# Altium schematic sheet button_mcu.SchDoc
size A4
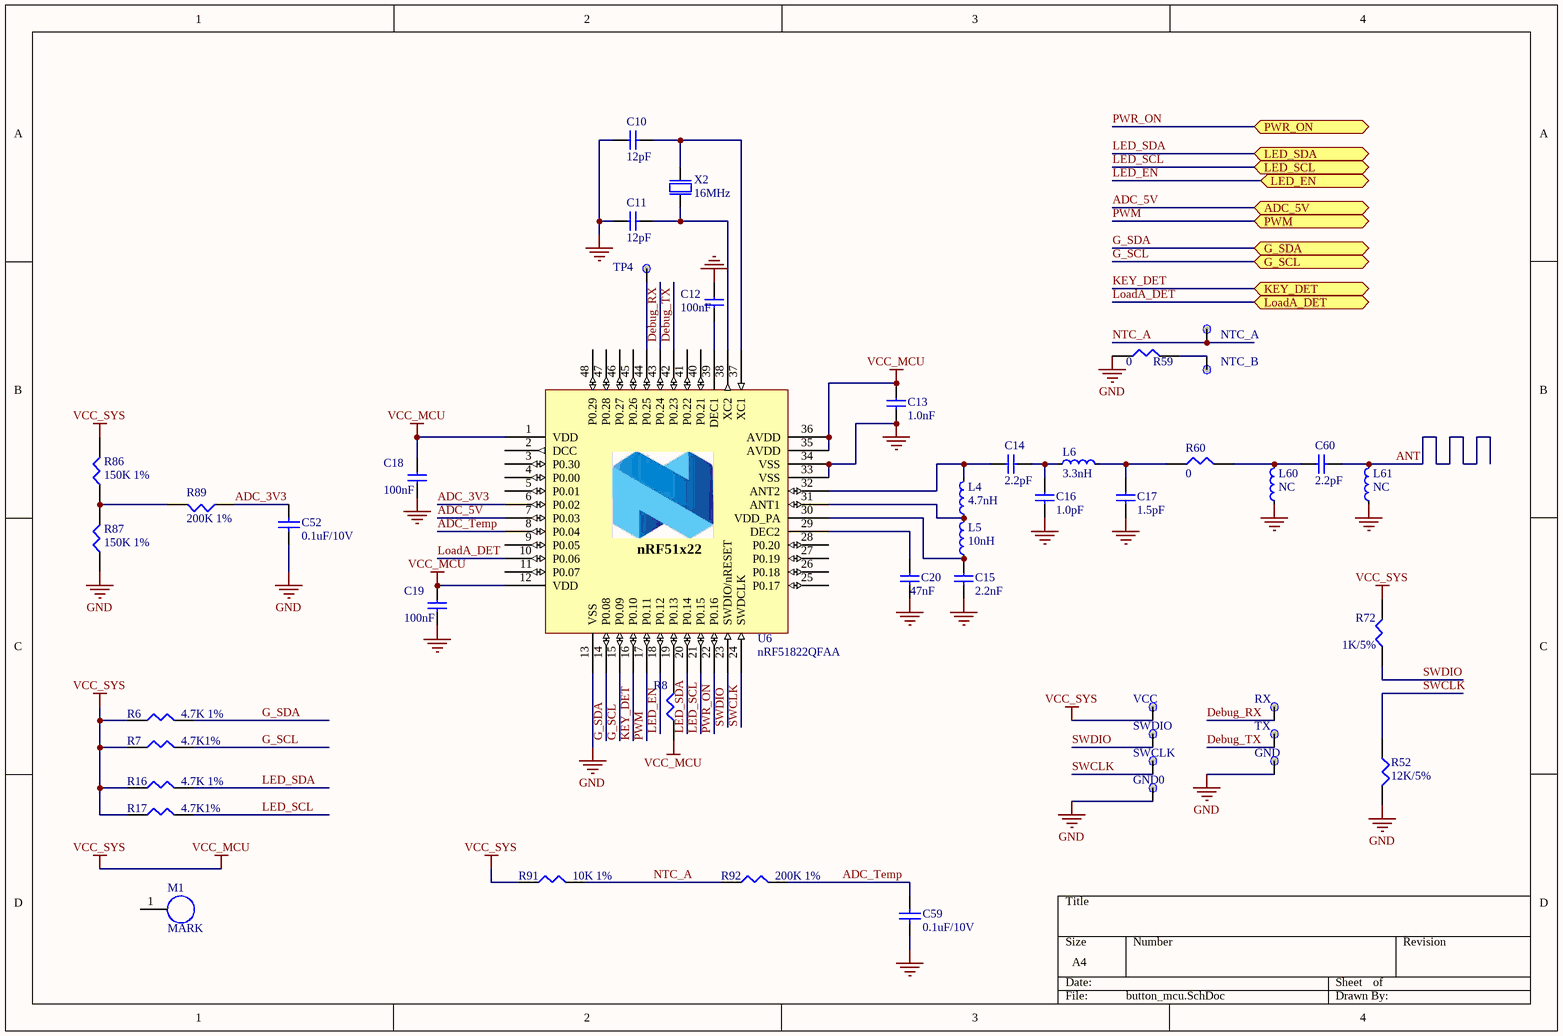
[diagram p0: button_mcu.SchDoc]

## Parts
C10  12pF  [CAPC1005X04L]
C11  12pF  [CAPC1005X04L]
C12  100nF  [CAPC1005X04L]
C13  1.0nF  [CAPC1005X04L]
C14  2.2pF  [CAPC1005X04L]
C15  2.2nF  [CAPC1005X04L]
C16  1.0pF  [CAPC1005X04L]
C17  1.5pF  [CAPC1005X04L]
C18  100nF  [CAPC1005X04L]
C19  100nF  [CAPC1005X04L]
C20  47nF  [CAPC1005X04L]
C52  0.1uF/10V  [0402C]
C59  0.1uF/10V  [0402C]
C60  2.2pF  [0402C]
GND  TP  [TESTPOINT2]  (value not drawn)
GND0  TP  [TESTPOINT2]  (value not drawn)
L4  4.7nH  [INDC1005X04L]
L5  10nH  [INDC1005X04L]
L6  3.3nH  [INDC1005X04L]
L60  NC  [0402R]
L61  NC  [0402R]
M1  MARK  [Mark Point]
NTC_A  TP  [TESTPOINT_PAD]  (value not drawn)
NTC_B  TP  [TESTPOINT_PAD]  (value not drawn)
R6  4.7K 1%  [0402R]
R7  4.7K1%  [0402R]
R8  1K 5%  [0402R]  (value not drawn)
R16  4.7K 1%  [0402R]
R17  4.7K1%  [0402R]
R52  12K/5%  [0402R]
R59  0  [0402R]
R60  0  [0402R]
R72  1K/5%  [0402R]
R86  150K 1%  [0402R]
R87  150K 1%  [0402R]
R89  200K 1%  [0402R]
R91  10K 1%  [0402R]
R92  200K 1%  [0402R]
RX  TP  [TESTPOINT2]  (value not drawn)
SWCLK  TP  [TESTPOINT2]  (value not drawn)
SWDIO  TP  [TESTPOINT2]  (value not drawn)
TP4  TP  [TESTPOINT2]  (value not drawn)
TX  TP  [TESTPOINT2]  (value not drawn)
U6  nRF51822QFAA  [QFN40P600X600X90-48N]
VCC  TP  [TESTPOINT2]  (value not drawn)
X2  16MHz  [XTAL/3225]

## Ports
ADC_5V, G_SCL, G_SDA, KEY_DET, LED_EN, LED_SCL, LED_SDA, LoadA_DET, PWM, PWR_ON

## Nets
GND: C10.2 C11.2 C12.1 C13.2 C15.2 C16.2 C17.2 C18.2 C19.2 C20.2 C52.1 C59.1 GND.1 GND0.1 L60.1 L61.1 R52.2 R59.1 R87.1 U6.13(VSS) U6.33(VSS) U6.34(VSS) U6.49 X2.2(GND) X2.4(GND)
VCC_MCU: C13.1 C18.1 C19.1 R6.1 R7.1 R8.1 R16.1 R17.1 R72.2 R86.2 R91.1 U6.1(VDD) U6.12(VDD) U6.35(AVDD) U6.36(AVDD) VCC.1  [also labelled VCC_SYS]
ADC_3V3: C52.2 R89.1 U6.6(P0.02)
ADC_5V: U6.7(P0.03) ; port ADC_5V
ADC_Temp: C59.2 R92.2 U6.8(P0.04)
ANT: C60.2 L61.2
Debug_RX: RX.1 U6.43(P0.24)
Debug_TX: TX.1 U6.42(P0.23)
G_SCL: R7.2 U6.15(P0.09) ; port G_SCL
G_SDA: R6.2 U6.14(P0.08) ; port G_SDA
KEY_DET: U6.16(P0.10) ; port KEY_DET
LED_EN: U6.18(P0.12) ; port LED_EN
LED_SCL: R17.2 U6.21(P0.15) ; port LED_SCL
LED_SDA: R16.2 U6.20(P0.14) ; port LED_SDA
LoadA_DET: U6.10(P0.06) ; port LoadA_DET
NTC_A: NTC_A.1 R91.2 R92.1
PWM: U6.17(P0.11) ; port PWM
PWR_ON: U6.22(P0.16) ; port PWR_ON
SWCLK: R52.1 SWCLK.1 U6.24(SWDCLK)
SWDIO: R72.1 SWDIO.1 U6.23(SWDIO/nRESET)
NetC10_1: C10.1 U6.37(XC1) X2.1(inp)
NetC11_1: C11.1 U6.38(XC2) X2.3(out)
NetC12_2: C12.2 U6.39(DEC1)
NetC14_1: C14.1 L4.2 U6.32(ANT2)
NetC14_2: C14.2 C16.1 L6.1
NetC15_1: C15.1 L5.1 U6.30(VDD_PA)
NetC17_1: C17.1 L6.2 R60.1
NetC20_1: C20.1 U6.29(DEC2)
NetC60_1: C60.1 L60.2 R60.2
NetL4_1: L4.1 L5.2 U6.31(ANT1)
NetNTC_B_1: NTC_B.1 R59.2
NetR8_2: R8.2 U6.19(P0.13)
NetR86_1: R86.1 R87.2 R89.2
NetTP4_1: TP4.1 U6.44(P0.25)

Not connected (* = marked no-connect by the designer): M1 1; U6 2(DCC) 3(P0.30) 4(P0.00) 5(P0.01) 9(P0.05) 11(P0.07) 25(P0.17) 26(P0.18) 27(P0.19) 28(P0.20) 40(P0.21) 41(P0.22) 45(P0.26) 46(P0.27) 47(P0.28) 48(P0.29)

## Notes on the sheet
- (in symbol nRF51x22-QFAC) nRF51x22

## Library data of the parts
C10 C11 = C0402-12p: Capacitor, NP0, ±2%; Note: 50V; Artikkelnr Noca: 20029159; Artikkelnr Simpro: N.A.; Part Number: C0402-12p; Manufacturer: *; Manufacturer Part Number: *; Datasheet: *; LatestRevisionDate: 2011-05-11; Pin Count: 2; Publisher: Nordic Semiconductor; Published: 2009-05-08; Value: 12pF; Supplier: *; Supplier part number: *; 2nd source Supplier: *; 2nd source part number: *; Footprint Doc: 0402
C12 C18 C19 = C0402-100n: Capacitor, X7R, ±10%; Note: 16V; Artikkelnr Noca: 20039200; Artikkelnr Simpro: N.A.; Part Number: C0402-100n; Manufacturer: *; Manufacturer Part Number: *; Datasheet: *; LatestRevisionDate: 2009-11-23; Pin Count: 2; Publisher: Nordic Semiconductor; Published: 2009-05-08; Value: 100nF; Supplier: *; Supplier part number: *; 2nd source Supplier: *; 2nd source part number: *; Footprint Doc: 0402
C13 = C0402-1n0: Capacitor, X7R, ±10%; Note: 50V; Artikkelnr Noca: 20039223; Artikkelnr Simpro: N.A.; Part Number: C0402-1n0; Manufacturer: *; Manufacturer Part Number: *; Datasheet: *; LatestRevisionDate: 2009-11-23; Pin Count: 2; Publisher: Nordic Semiconductor; Published: 2009-05-08; Value: 1.0nF; Supplier: *; Supplier part number: *; 2nd source Supplier: *; 2nd source part number: *; Footprint Doc: 0402
C14 C60 = C0402-3.9p: Capacitor, NP0, ±0.1pF; Value: 3.9pF; Note: 50V; Artikkelnr Noca: N.A.; Part Number: C0402-3.9p; Manufacturer: *; Manufacturer Part Number: *; Datasheet: *; LatestRevisionDate: 2014-09-17; Pin Count: 2; Publisher: Nordic Semiconductor; Published: 2009-05-08; Supplier: *; Supplier part number: *; 2nd source Supplier: *; 2nd source part number: *; Footprint Doc: 0402; Artikkelnr Simpro: N.A.
C15 = C0402-2n2: Capacitor, X7R, ±10%; Note: 50V; Artikkelnr Noca: 20039221; Artikkelnr Simpro: N.A.; Part Number: C0402-2n2; Manufacturer: *; Manufacturer Part Number: *; Datasheet: *; LatestRevisionDate: 2009-11-23; Pin Count: 2; Publisher: Nordic Semiconductor; Published: 2009-05-08; Value: 2.2nF; Supplier: *; Supplier part number: *; 2nd source Supplier: *; 2nd source part number: *; Footprint Doc: 0402
C16 = C0402-1.0p: Capacitor, NP0, ±0.1pF; Note: 50V; Artikkelnr Noca: 20029140; Artikkelnr Simpro: N.A.; Part Number: C0402-1.0p; Manufacturer: *; Manufacturer Part Number: *; Datasheet: *; LatestRevisionDate: 2009-11-23; Pin Count: 2; Publisher: Nordic Semiconductor; Published: 2009-05-08; Value: 1.0pF; Supplier: *; Supplier part number: *; 2nd source Supplier: *; 2nd source part number: *; Footprint Doc: 0402
C17 = C0402-1.5p: Capacitor, NP0, ±0.1pF; Note: 50V; Artikkelnr Noca: 20029139; Artikkelnr Simpro: N.A.; Part Number: C0402-1.5p; Manufacturer: *; Manufacturer Part Number: *; Datasheet: *; LatestRevisionDate: 2009-11-23; Pin Count: 2; Publisher: Nordic Semiconductor; Published: 2009-05-08; Value: 1.5pF; Supplier: *; Supplier part number: *; 2nd source Supplier: *; 2nd source part number: *; Footprint Doc: 0402
C20 = C0402-47n: Capacitor, X7R, ±10%; Note: Chip Cap 10%; Artikkelnr Noca: 20039389; Artikkelnr Simpro: N.A.; Part Number: C0402-47n; Manufacturer: *; Manufacturer Part Number: *; Datasheet: *; LatestRevisionDate: 2009-05-08; Pin Count: 2; Publisher: Nordic Semiconductor; Published: 2009-05-08; Value: 47nF; Supplier: *; Supplier part number: *; 2nd source Supplier: *; 2nd source part number: *; Footprint Doc: 0402
C52 C59 = CAP: Capacitor; Value: 100pF; Ordered by: Subcon; Published: 8-Jun-2000; Revision: July-2002: Re-released for DXP Platform.; Publisher: Altium Limited
GND GND0 NTC_A NTC_B RX SWCLK SWDIO TP4 TX VCC = TP: Ordered by: Subcon
L4 = L0402-4n7: High frequency chip inductor ±5%; Manufacturer: Murata; Manufacturer Part Number: LQP15MN4N7B02D; Artikkelnr Noca: 33029164; Artikkelnr Simpro: N.A.; Part Number: L0402-4n7; Datasheet: http://search.murata.co.jp/Ceramy/image/img/PDF/ENG/L0075S0084LQP15M.pdf; LatestRevisionDate: 2012-09-19; Pin Count: 2; Publisher: Nordic Semiconductor; Published: 2009-05-08; Value: 4.7nH; Note: High frequency chip inductor ±5%; Supplier: Digi-Key; Supplier part number: 490-1132-1-ND; 2nd source Supplier: *; 2nd source part number: *; Footprint Doc: 0402
L5 = L0402-27n: High frequency chip inductor ±5%; Manufacturer: Murata; Manufacturer Part Number: LQP15MN27NG02D; Value: 27nH; Note: High frequency chip inductor ±2%; Artikkelnr Noca: N.A.; Part Number: L0402-27n; Datasheet: http://search.murata.co.jp/Ceramy/image/img/PDF/ENG/L0075S0084LQP15M.pdf; LatestRevisionDate: 2014-09-17; Pin Count: 2; Publisher: Nordic Semiconductor; Published: 2014-06-12; Supplier: Digi-Key; Supplier part number: 490-6751-1-ND; 2nd source Supplier: *; 2nd source part number: *; Footprint Doc: 0402; Artikkelnr Simpro: N.A.
L6 = L0402-3n3: High frequency chip inductor ±5%; Manufacturer: Murata; Manufacturer Part Number: LQP15MN3N3B02D; Artikkelnr Noca: 33029369; Artikkelnr Simpro: N.A.; Part Number: L0402-3n3; Datasheet: http://search.murata.co.jp/Ceramy/image/img/PDF/ENG/L0075S0084LQP15M.pdf; LatestRevisionDate: 2012-09-19; Pin Count: 2; Publisher: Nordic Semiconductor; Published: 2009-05-08; Value: 3.3nH; Note: High frequency chip inductor ±5%; Supplier: Digi-Key; Supplier part number: 490-1130-1-ND; 2nd source Supplier: *; 2nd source part number: *; Footprint Doc: 0402
L60 L61 = L0402-4n7: High frequency chip inductor ±5%; Manufacturer: Murata; Manufacturer Part Number: LQP15MN4N7B02D; Value: 4.7nH; Artikkelnr Noca: 33029164; Artikkelnr Simpro: N.A.; Part Number: L0402-4n7; Datasheet: http://search.murata.co.jp/Ceramy/image/img/PDF/ENG/L0075S0084LQP15M.pdf; LatestRevisionDate: 2012-09-19; Pin Count: 2; Publisher: Nordic Semiconductor; Published: 2009-05-08; Note: High frequency chip inductor ±5%; Supplier: Digi-Key; Supplier part number: 490-1132-1-ND; 2nd source Supplier: *; 2nd source part number: *; Footprint Doc: 0402
M1 = PAD1: None
R6-R8 R16 R17 R52 R59 R60 R72 R86 R87 R89 R91 R92 = RES1: 厂家：Yageo，型号：RC0402FR-0720RL
U6 = nRF51x22-QFAC: Multi-protocol Bluetooth Low Energy, ANT and 2.4GHz proprietary system-on-chip; Manufacturer: Nordic Semiconductor; Note: nRF51422 - QFN48 6x6 0.4mm pitch; Artikkelnr Noca: N.A.; Part Number: nRF51x22-QFAC; Manufacturer Part Number: nRF51x22-QFAC; Datasheet: *; LatestRevisionDate: 2014-09-24; Pin Count: 48; Publisher: Nordic Semiconductor; Published: 2014-09-24; Value: nRF51x22-QFAC; Supplier: Nordic Semiconductor; Supplier part number: *; 2nd source Supplier: *; 2nd source part number: *; Footprint Doc: QFN-48; Artikkelnr Simpro: N.A.
X2 = NX2520SA-16MHZ-STD-CSW-5: XTAL SMD 2520, 16MHz, 8pF, ±40ppm; Manufacturer: NDK; Note: XTAL SMD 16.000MHz; Artikkelnr Noca: 22019192; Artikkelnr Simpro: N.A.; Part Number: NX2520SA-16MHZ-STD-CSW-5; Manufacturer Part Number: NX2520SA-16MHZ-STD-CSW-5; Datasheet: http://www.ndk.com/images/products/catalog/c_NX2520SA-STD-CSW-5_e.pdf; LatestRevisionDate: 2012-06-15; Pin Count: 4; Publisher: Nordic Semiconductor; Published: 2012-06-15; Value: 16MHz; Supplier: Digi-Key; Supplier part number: 644-1169-1-ND; 2nd source Supplier: *; 2nd source part number: *; Footprint Doc: BT-XTAL_2520